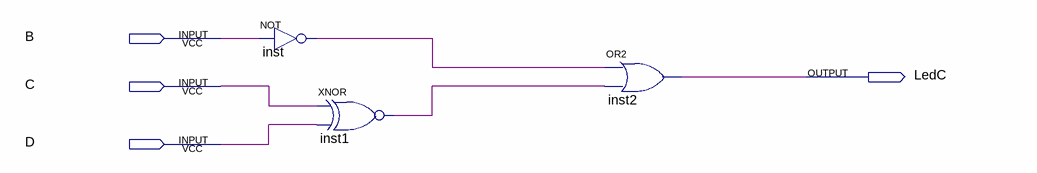
[diagram p0: schematic sheet]
// Quartus schematic LEDbcdC.bdf as structural Verilog: 3 symbols, 4 pins
module LEDbcdC (
  input  B,
  input  C,
  input  D,
  output LedC
);

  wire inst1_out, inst_out;

  not inst (inst_out, B);
  xnor inst1 (inst1_out, C, D);
  or inst2 (LedC, inst_out, inst1_out);
endmodule
